# Altium schematic sheet current sense.SchDoc
size A4; SheetNumber: 4; SheetTotal: 8
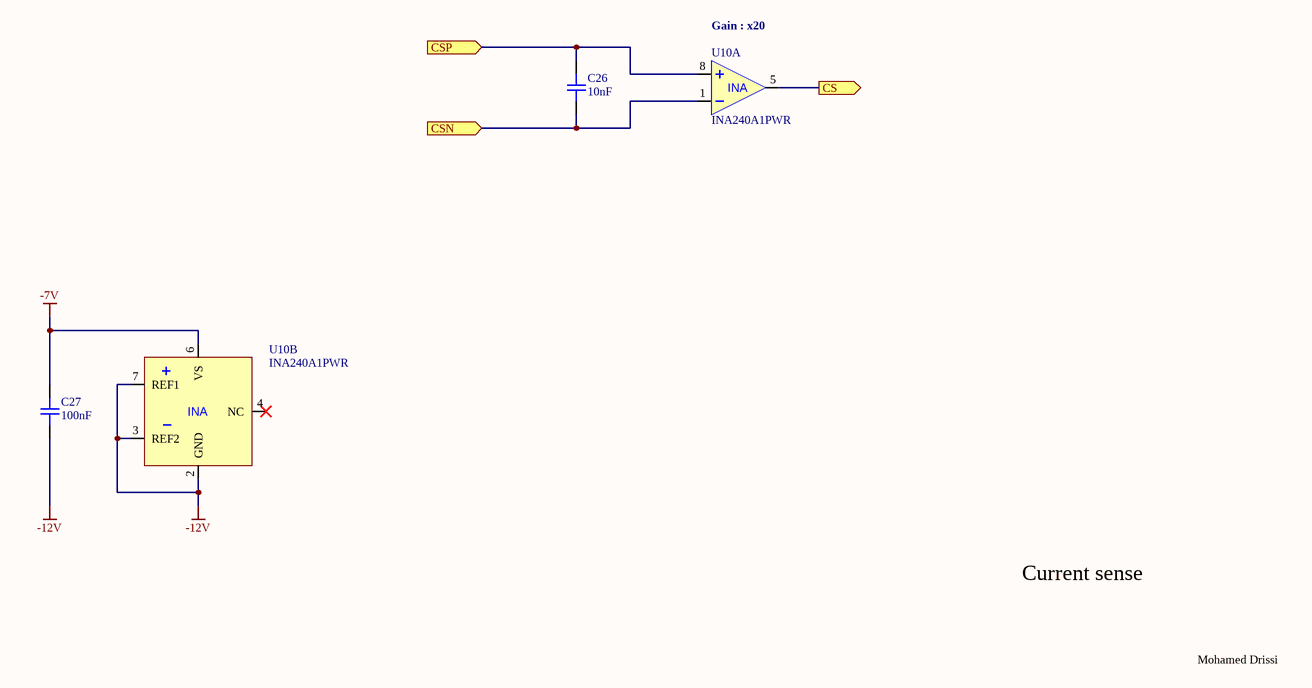
[diagram p0: current sense.SchDoc]

## Parts
C26  Capacitance: 10nF  [cap_0603]  (hidden comment: C0603C103K4RACTU)
C27  Capacitance: 100nF  [cap_0603]  (hidden comment: GMC10X7R104K100NT)
U10  INA240A1PWR  [SOIC]  (parts A,B of 2)

## Ports
CS (out, see Main[3C], Control circuit[2B], Protections[4A]), CSN (in, see Main[3B], Power stage[3A]), CSP (in, see Main[3B], Power stage[2A])

## Nets
-7V: C27.2 U10.6(VS)
-12V: C27.1 U10.2(GND) U10.3(REF2) U10.7(REF1)
CS: U10.5(OUT) ; port CS
CSN: C26.1 U10.1(IN-) ; port CSN
CSP: C26.2 U10.8(IN+) ; port CSP

Not connected (* = marked no-connect by the designer): U10 4(NC)*

## Notes on the sheet
- (near U10) Gain : x20
- Current sense
- Mohamed Drissi
- (in symbol TI INA240A1PWR, part A) INA
- (in symbol TI INA240A1PWR, part B) INA

## Library data of the parts
C26 = Yageo C0603C103K4RACTU: Multilayer Ceramic Capacitors MLCC - SMD/SMT 16V 0.01uF X7R 0603 10%; Manufacturer: Yageo Group; Dissipation Factor: 3.5%; Temperature Coefficient: 30ppm/°C; Supplier: Farnell; Supplier Part Number: C0603C103K4RACTU; Manufacturer Part Number: C0603C103K4RACTU; RoHS: Compliant; Category: Ceramic Capacitors; Stock: 16775; Pricing: 10=0,0275, 100=0,0212, 500=0,0177, 1000=0,0142, 2000=0,0133 (GBP); Case/Package: 0603; Case Code (Imperial): 0603; Case Code (Metric): 1608; China RoHS: Compliant; Country of Origin: Mexico; Depth: 800µm; Dielectric: X7R; Dielectric Material: Ceramic; Export Control Classification Number (ECCN) Code: EAR99; Height: 800µm; Harmonized Tariff Schedule (HTS) Code: 8532.24.00.20; Introduction Date: 2008-01-10; Lead Pitch: 700µm; Length: 1.6mm; Lifecycle Status: Production; Material: Ceramic; Max Operating Temperature: 125°C; Min Operating Temperature: -55°C; Mounting Technology: Surface Mount; Pins: 2; Number of Terminals: 2; Packaging: Cut Tape; Radiation Hardening: No; REACH SVHC: Yes; Schedule B: 8532240020, 8532240020|8532240020, 8532240020|8532240020|8532240020, 8532240020|8532240020|8532240020|8532240020; Termination: SMD/SMT; Thickness: 863.6µm; Tolerance: 10%; Voltage Rating: 16V; Voltage Rating (DC): 16V; Width: 800µm; ComponentLink1URL: https://datasheet.octopart.com:443/C0603C103K4RACTU-KEMET-datasheet-178445679.pdf?src-supplier=IHS; ComponentLink1Description: https://datasheet.octopart.com:443/C0603C103K4RACTU-KEMET-datasheet-178445679.pdf?src-supplier=IHS; ComponentLink2URL: https://datasheet.octopart.com:443/C0603C103K4RAC7867-KEMET-datasheet-184792798.pdf?src-supplier=IHS; ComponentLink2Description: https://datasheet.octopart.com:443/C0603C103K4RAC7867-KEMET-datasheet-184792798.pdf?src-supplier=IHS; ComponentLink3URL: https://datasheet.octopart.com:443/C0603C103K4RACTU-KEMET-datasheet-137357759.pdf?src-supplier=Farnell; ComponentLink3Description: https://datasheet.octopart.com:443/C0603C103K4RACTU-KEMET-datasheet-137357759.pdf?src-supplier=Farnell; ComponentLink4URL: https://datasheet.octopart.com:443/C0603C103K4RACTU-Kemet-datasheet-5313890.pdf?src-supplier=Farnell; ComponentLink4Description: https://datasheet.octopart.com:443/C0603C103K4RACTU-Kemet-datasheet-5313890.pdf?src-supplier=Farnell; ComponentLink5URL: https://datasheet.octopart.com:443/C0603C103K4RACTU-Kemet-datasheet-12608295.pdf?src-supplier=Farnell; ComponentLink5Description: https://datasheet.octopart.com:443/C0603C103K4RACTU-Kemet-datasheet-12608295.pdf?src-supplier=Farnell; ComponentLink6URL: https://datasheet.octopart.com:443/C0603C103K4RACTU-Kemet-datasheet-11992184.pdf?src-supplier=Farnell; ComponentLink6Description: https://datasheet.octopart.com:443/C0603C103K4RACTU-Kemet-datasheet-11992184.pdf?src-supplier=Farnell; ComponentLink7URL: https://datasheet.octopart.com:443/C0603C103K4RACTU-Kemet-datasheet-10942409.pdf?src-supplier=Farnell; ComponentLink7Description: https://datasheet.octopart.com:443/C0603C103K4RACTU-Kemet-datasheet-10942409.pdf?src-supplier=Farnell; ComponentLink8URL: https://datasheet.octopart.com:443/C0603C103K4RACTU-Kemet-datasheet-10404442.pdf?src-supplier=Farnell; ComponentLink8Description: https://datasheet.octopart.com:443/C0603C103K4RACTU-Kemet-datasheet-10404442.pdf?src-supplier=Farnell; ComponentLink9URL: https://datasheet.octopart.com:443/C0603C103K4RACTU-Kemet-datasheet-8764837.pdf?src-supplier=Farnell; ComponentLink9Description: https://datasheet.octopart.com:443/C0603C103K4RACTU-Kemet-datasheet-8764837.pdf?src-supplier=Farnell; ComponentLink10URL: https://datasheet.octopart.com:443/C0603C103K4RACTU-Kemet-datasheet-8480123.pdf?src-supplier=Farnell; ComponentLink10Description: https://datasheet.octopart.com:443/C0603C103K4RACTU-Kemet-datasheet-8480123.pdf?src-supplier=Farnell; ComponentLink11URL: https://datasheet.octopart.com:443/C0603C103K4RACTU-Kemet-datasheet-5390537.pdf?src-supplier=Farnell; ComponentLink11Description: https://datasheet.octopart.com:443/C0603C103K4RACTU-Kemet-datasheet-5390537.pdf?src-supplier=Farnell; ComponentLink12URL: https://datasheet.octopart.com:443/C0603C103K4RACTU-Kemet-datasheet-5393970.pdf?src-supplier=Farnell; ComponentLink12Description: https://datasheet.octopart.com:443/C0603C103K4RACTU-Kemet-datasheet-5393970.pdf?src-supplier=Farnell; ComponentLink13URL: https://datasheet.octopart.com:443/C0603C103K4RACTU-Kemet-datasheet-8502025.pdf?src-supplier=Farnell; ComponentLink13Description: https://datasheet.octopart.com:443/C0603C103K4RACTU-Kemet-datasheet-8502025.pdf?src-supplier=Farnell; ComponentLink14URL: https://datasheet.octopart.com:443/C0603C103K4RACTU-Kemet-datasheet-7541751.pdf?src-supplier=Farnell; ComponentLink14Description: https://datasheet.octopart.com:443/C0603C103K4RACTU-Kemet-datasheet-7541751.pdf?src-supplier=Farnell; ComponentLink15URL: https://datasheet.octopart.com:443/C0603C103K4RACTU-Kemet-datasheet-161801.pdf?src-supplier=Farnell; ComponentLink15Description: https://datasheet.octopart.com:443/C0603C103K4RACTU-Kemet-datasheet-161801.pdf?src-supplier=Farnell; ComponentLink16URL: https://datasheet.octopart.com:443/C0603C103K4RACTU-KEMET-datasheet-101575644.pdf?src-supplier=Farnell; ComponentLink16Description: https://datasheet.octopart.com:443/C0603C103K4RACTU-KEMET-datasheet-101575644.pdf?src-supplier=Farnell; ComponentLink17URL: https://datasheet.octopart.com:443/C0603C103K4RACTU.-Kemet-datasheet-41232427.pdf?src-supplier=Farnell; ComponentLink17Description: https://datasheet.octopart.com:443/C0603C103K4RACTU.-Kemet-datasheet-41232427.pdf?src-supplier=Farnell; ComponentLink18URL: https://datasheet.octopart.com:443/C0603C103K4RACTU-Kemet-datasheet-24570007.pdf?src-supplier=Farnell; ComponentLink18Description: https://datasheet.octopart.com:443/C0603C103K4RACTU-Kemet-datasheet-24570007.pdf?src-supplier=Farnell; ComponentLink19URL: https://datasheet.octopart.com:443/C0603C103K4RACTU-Kemet-datasheet-22084244.pdf?src-supplier=Farnell; ComponentLink19Description: https://datasheet.octopart.com:443/C0603C103K4RACTU-Kemet-datasheet-22084244.pdf?src-supplier=Farnell; ComponentLink20URL: https://datasheet.octopart.com:443/C0603C103K4RACTU-KEMET-datasheet-137357764.pdf?src-supplier=Upverter; ComponentLink20Description: https://datasheet.octopart.com:443/C0603C103K4RACTU-KEMET-datasheet-137357764.pdf?src-supplier=Upverter; ComponentLink21URL: https://datasheet.octopart.com:443/C0603C103K4RACTU-KEMET-datasheet-149521824.pdf?src-supplier=Newark; ComponentLink21Description: https://datasheet.octopart.com:443/C0603C103K4RACTU-KEMET-datasheet-149521824.pdf?src-supplier=Newark; ComponentLink22URL: https://datasheet.octopart.com:443/C0603C103K4RACTU-KEMET-datasheet-176289389.pdf?src-supplier=Newark; ComponentLink22Description: https://datasheet.octopart.com:443/C0603C103K4RACTU-KEMET-datasheet-176289389.pdf?src-supplier=Newark; ComponentLink23URL: https://datasheet.octopart.com:443/C0603C103K4RACTU-KEMET-datasheet-130256537.pdf?src-supplier=Newark; ComponentLink23Description: https://datasheet.octopart.com:443/C0603C103K4RACTU-KEMET-datasheet-130256537.pdf?src-supplier=Newark; ComponentLink24URL: https://datasheet.octopart.com:443/C0603C103K4RACTU-KEMET-datasheet-157246124.pdf?src-supplier=Electro+Sonic; ComponentLink24Description: https://datasheet.octopart.com:443/C0603C103K4RACTU-KEMET-datasheet-157246124.pdf?src-supplier=Electro+Sonic; ComponentLink25URL: https://datasheet.octopart.com:443/C0603C103K4RACTU-KEMET-datasheet-32036385.pdf?src-supplier=Electro+Sonic; ComponentLink25Description: https://datasheet.octopart.com:443/C0603C103K4RACTU-KEMET-datasheet-32036385.pdf?src-supplier=Electro+Sonic; ComponentLink26URL: https://datasheet.octopart.com:443/C0603C103K4RACTU-KEMET-datasheet-164512540.pdf?src-supplier=TME; ComponentLink26Description: https://datasheet.octopart.com:443/C0603C103K4RACTU-KEMET-datasheet-164512540.pdf?src-supplier=TME; ComponentLink27URL: https://datasheet.octopart.com:443/C0603C103K4RACTU-KEMET-datasheet-68321734.pdf?src-supplier=TME; ComponentLink27Description: https://datasheet.octopart.com:443/C0603C103K4RACTU-KEMET-datasheet-68321734.pdf?src-supplier=TME; ComponentLink28URL: https://datasheet.octopart.com:443/C0603C103K4RACTU-KEMET-datasheet-68331906.pdf?src-supplier=TME; ComponentLink28Description: https://datasheet.octopart.com:443/C0603C103K4RACTU-KEMET-datasheet-68331906.pdf?src-supplier=TME; ComponentLink29URL: https://datasheet.octopart.com:443/C0603C103K4RACTU-KEMET-datasheet-110724412.pdf?src-supplier=RS+(Formerly+Allied+Electronics); ComponentLink29Description: https://datasheet.octopart.com:443/C0603C103K4RACTU-KEMET-datasheet-110724412.pdf?src-supplier=RS+(Formerly+Allied+Electronics); ComponentLink30URL: https://datasheet.octopart.com:443/C0603C103K4RACTU-Kemet-datasheet-60243841.pdf?src-supplier=RS+(Formerly+Allied+Electronics); ComponentLink30Description: https://datasheet.octopart.com:443/C0603C103K4RACTU-Kemet-datasheet-60243841.pdf?src-supplier=RS+(Formerly+Allied+Electronics); ComponentLink31URL: https://datasheet.octopart.com/C0603C103K4RACTU-KEMET-datasheet-84169754.pdf; ComponentLink31Description: https://datasheet.octopart.com/C0603C103K4RACTU-KEMET-datasheet-84169754.pdf; ComponentLink32URL: https://datasheet.octopart.com:443/C0603C103K4RAC-TU-Kemet-datasheet-7838125.pdf?src-supplier=Jameco; ComponentLink32Description: https://datasheet.octopart.com:443/C0603C103K4RAC-TU-Kemet-datasheet-7838125.pdf?src-supplier=Jameco; ComponentLink33URL: http://sigma.octopart.com:80/conflict_mineral_statement/Yageo-company-3.pdf?src-supplier=Compliance+Statements; ComponentLink33Description: http://sigma.octopart.com:80/conflict_mineral_statement/Yageo-company-3.pdf?src-supplier=Compliance+Statements; ComponentLink34URL: http://sigma.octopart.com:80/rohs_statement/Yageo-company-2.pdf?src-supplier=Compliance+Statements; ComponentLink34Description: http://sigma.octopart.com:80/rohs_statement/Yageo-company-2.pdf?src-supplier=Compliance+Statements
C27 = Cal-chip GMC10X7R104K100NT: 100V 100nF X7R ±10% 0603 Multilayer Ceramic Capacitors MLCC - SMD/SMT ROHS; Manufacturer: Cal-Chip Electronics; Supplier: DigiKey; Supplier Part Number: 4713-GMC10X7R104K100NTCT-ND; Manufacturer Part Number: GMC10X7R104K100NT; RoHS: Compliant; Category: Ceramic Capacitors; Stock: 34767; Pricing: 1=0,1, 10=0,045, 50=0,0306, 100=0,0262, 500=0,01902, 1000=0,0168 (USD); Case/Package: 0603; China RoHS: Compliant; Dielectric Material: Ceramic; Height: 950µm; Length: 1.6mm; Lifecycle Status: Production; Max Operating Temperature: 125°C; Min Operating Temperature: -55°C; Mounting Technology: Surface Mount; Number of Terminals: 2; REACH SVHC: Yes; Voltage Rating (DC): 100V; Width: 800µm; ComponentLink1URL: https://datasheet.octopart.com:443/GMC10X7R104K100NT-Cal-Chip-Electronics-datasheet-182028815.pdf?src-supplier=IHS; ComponentLink1Description: https://datasheet.octopart.com:443/GMC10X7R104K100NT-Cal-Chip-Electronics-datasheet-182028815.pdf?src-supplier=IHS
U10 = TI INA240A1PWR: Op Amp Single Zero Drift Amplifier 5.5V 8-Pin TSSOP T/R; Manufacturer: Texas Instruments; Manufacturer Lifecycle Status: ACTIVE; Bandwidth: 400kHz; Input Bias Current: 90µA; Input Offset Voltage (Vos): 5µV; Max Junction Temperature (Tj): 150°C; Min Supply Voltage: 2.7V; Nominal Supply Current: 1.8mA; Number of Channels: 1; Supplier: Arrow Electronics; Supplier Part Number: INA240A1PWR; Manufacturer Part Number: INA240A1PWR; RoHS: Compliant; Category: Amplifiers - Op Amps, Buffer, Instrumentation; Stock: 449; Pricing: 1=3,1221, 10=2,403, 25=2,2062, 100=1,9491, 250=1,84 (USD); Ambient Temperature Range High: 125°C; Case/Package: TSSOP; Height: 1.2mm; Lead Free: Lead Free; Length: 3mm; Lifecycle Status: Production; Max Operating Temperature: 125°C; Max Supply Voltage: 5.5V; Min Operating Temperature: -40°C; Pins: 8; Packaging: Cut Tape; Schedule B: 8542390000, 8542390000|8542390000|8542390000|8542390000|8542390000; Thickness: 1mm; Width: 4.4mm; ComponentLink1URL: https://octopart.com:443/opatz8j6/c1?t=6b5ds5zphu4iqUhGNAPiVHzmQf_HL7e1E5UT2beWP4N2AUke_jOvonAQg0R4M0fKF8_rOW3PQdhUTq9RbFr9x0koj0vt9WEXvQIr2Xb8W6mrYAbRTeGV92QdBvy7W47PufrnRYDulXaXNo6SzTOmflcuzpg__6qv2Cnz6zhuL4qfO7rFJ3GiUIC-sSgXLYJxZFQl6eX-9KFvOiRir4o1IB0ufZchFYOXq5pnhEqDmivBzqZyEXrKsef3SNQzWVhfEPUQ_HYUNfeqlLpMriLHn-U6iJiVIypTpS419iyJOhV020lbUEaR7jMQnHtQpCB4MuonRBeDH0zcF8XPK3nYA9RAaNVtgVJQ_IBr8E6FLEFkoip-xrFWLKqSqo7VXkO8ZHfHXQ&src-supplier=Texas+Instruments; ComponentLink1Description: https://octopart.com:443/opatz8j6/c1?t=6b5ds5zphu4iqUhGNAPiVHzmQf_HL7e1E5UT2beWP4N2AUke_jOvonAQg0R4M0fKF8_rOW3PQdhUTq9RbFr9x0koj0vt9WEXvQIr2Xb8W6mrYAbRTeGV92QdBvy7W47PufrnRYDulXaXNo6SzTOmflcuzpg__6qv2Cnz6zhuL4qfO7rFJ3GiUIC-sSgXLYJxZFQl6eX-9KFvOiRir4o1IB0ufZchFYOXq5pnhEqDmivBzqZyEXrKsef3SNQzWVhfEPUQ_HYUNfeqlLpMriLHn-U6iJiVIypTpS419iyJOhV020lbUEaR7jMQnHtQpCB4MuonRBeDH0zcF8XPK3nYA9RAaNVtgVJQ_IBr8E6FLEFkoip-xrFWLKqSqo7VXkO8ZHfHXQ&src-supplier=Texas+Instruments; ComponentLink2URL: https://sigma.octopart.com:443/49250270/technical_drawing/Texas-Instruments-INA240A1PWR.pdf?src-supplier=Texas+Instruments; ComponentLink2Description: https://sigma.octopart.com:443/49250270/technical_drawing/Texas-Instruments-INA240A1PWR.pdf?src-supplier=Texas+Instruments; ComponentLink3URL: https://datasheet.octopart.com:443/INA240A1PWR-Texas-Instruments-datasheet-100480378.pdf?src-supplier=Newark; ComponentLink3Description: https://datasheet.octopart.com:443/INA240A1PWR-Texas-Instruments-datasheet-100480378.pdf?src-supplier=Newark; ComponentLink4URL: https://datasheet.octopart.com:443/INA240A1PWR-Texas-Instruments-datasheet-68439366.pdf?src-supplier=element14+APAC; ComponentLink4Description: https://datasheet.octopart.com:443/INA240A1PWR-Texas-Instruments-datasheet-68439366.pdf?src-supplier=element14+APAC; ComponentLink5URL: https://datasheet.octopart.com:443/INA240A1PWR-Texas-Instruments-datasheet-165803933.pdf?src-supplier=LCSC; ComponentLink5Description: https://datasheet.octopart.com:443/INA240A1PWR-Texas-Instruments-datasheet-165803933.pdf?src-supplier=LCSC; ComponentLink6URL: https://datasheet.octopart.com:443/INA240A1PWR-Texas-Instruments-datasheet-160706886.pdf?src-supplier=LCSC; ComponentLink6Description: https://datasheet.octopart.com:443/INA240A1PWR-Texas-Instruments-datasheet-160706886.pdf?src-supplier=LCSC; ComponentLink7URL: https://datasheet.octopart.com:443/INA240A1PWR-Texas-Instruments-datasheet-147851276.pdf?src-supplier=SHENGYU+ELECTRONICS; ComponentLink7Description: https://datasheet.octopart.com:443/INA240A1PWR-Texas-Instruments-datasheet-147851276.pdf?src-supplier=SHENGYU+ELECTRONICS; ComponentLink8URL: https://datasheet.octopart.com:443/INA240A1PWR-Texas-Instruments-datasheet-140571434.pdf?src-supplier=Arrow.cn; ComponentLink8Description: https://datasheet.octopart.com:443/INA240A1PWR-Texas-Instruments-datasheet-140571434.pdf?src-supplier=Arrow.cn; ComponentLink9URL: http://sigma.octopart.com:80/reach_statement/Texas-Instruments-company-64.pdf?src-supplier=Compliance+Statements; ComponentLink9Description: http://sigma.octopart.com:80/reach_statement/Texas-Instruments-company-64.pdf?src-supplier=Compliance+Statements; ComponentLink10URL: http://sigma.octopart.com:80/conflict_mineral_statement/Texas-Instruments-company-63.pdf?src-supplier=Compliance+Statements; ComponentLink10Description: http://sigma.octopart.com:80/conflict_mineral_statement/Texas-Instruments-company-63.pdf?src-supplier=Compliance+Statements